# Altium schematic sheet MIRA050CSP-Sheet1.SchDoc: MIRA050 CSP
size A3; Date: 06-May-2024; CheckedBy: -not-used-; Author: -not-used-; CompanyName: AMS; DrawnBy: -not-used-; Engineer: MKOC; Organization: AMs; Address1: Borsbeeksebrug 36; Address2: 2600 Antwerpen; Address3: Belgium; Address4: T: +32 3 260 1730 | F: +32 3 260 1779; Revision: 3.0; SheetNumber: 1; SheetTotal: 1; PageSetup: Record=PageOptions|CenterHorizontal=True|CenterVertical=True|PrintScale=0.71|XCorrection=1.00|YCorrection=1.00|PrintKind=0|BorderSize=5000000|LeftOffset=0|BottomOffset=0|Orientation=2|PaperLength=1000|PaperWidth=1000|Scale=100|PaperSource=7|PrintQuality=-4|MediaType=1|DitherType=10|PrintScaleMode=1|PaperKind=A4|PaperIndex=9; Comment1: Reference Design; Project: MIRA050; ProjectName: -not-used-; Rule: PcbType=ProtelPcb
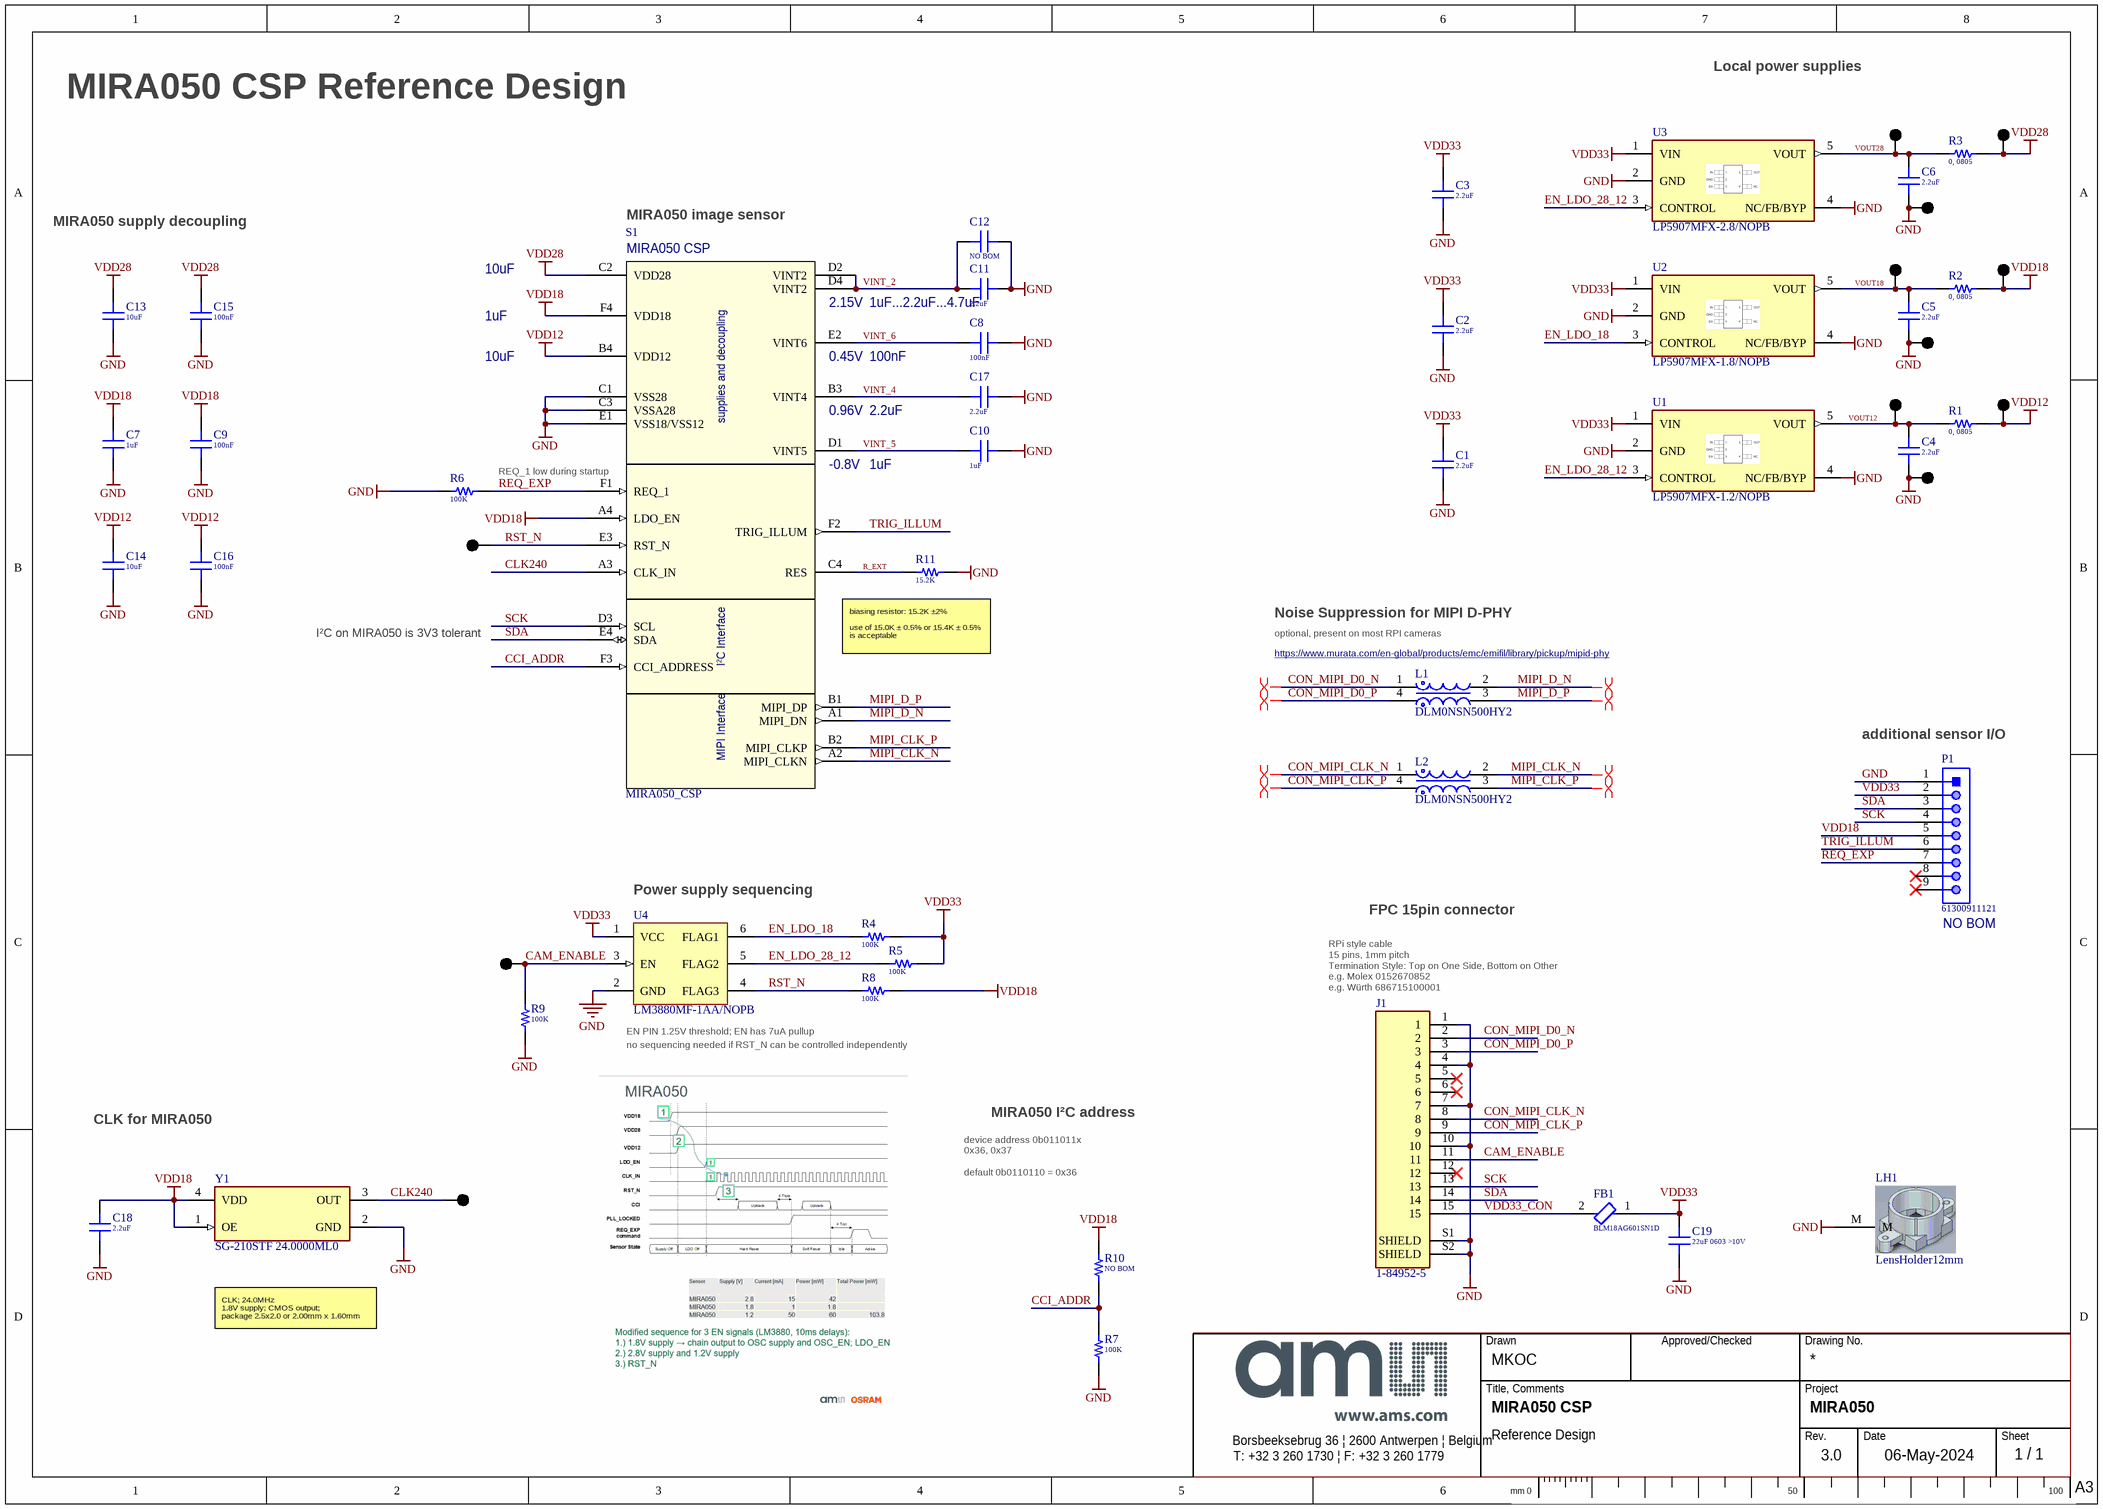
[diagram p0: MIRA050CSP-Sheet1.SchDoc]

## Parts
C1  2.2uF  [CAPC0402_BEMA]
C2  2.2uF  [CAPC0402_BEMA]
C3  2.2uF  [CAPC0402_BEMA]
C4  2.2uF  [CAPC0402_BEMA]
C5  2.2uF  [CAPC0402_BEMA]
C6  2.2uF  [CAPC0402_BEMA]
C7  1uF  [CAPC0402_BEMA]
C8  100nF  [CAPC0402_BEMA]
C9  100nF  [CAPC0402_BEMA]
C10  1uF  [CAPC0402_BEMA]
C11  2.2uF  [CAPC0402_N]
C12  NO BOM  [CAPC0402_N]  (no BOM)
C13  10uF  [CAPC0402_BEMA]
C14  10uF  [CAPC0402_BEMA]
C15  100nF  [CAPC0402_BEMA]
C16  100nF  [CAPC0402_BEMA]
C17  2.2uF  [CAPC0402_BEMA]
C18  2.2uF  [CAPC0402_BEMA]
C19  22uF 0603 >10V  [CAPC0603_BEMA]
FB1  BLM18AG601SN1D  [FP-BLM18-0_15-t0_8-IPC_B]
J1  1-84952-5  [TE_1-84952-5]
L1  DLM0NSN500HY2  [FP-DLM0N-MFG]
L2  DLM0NSN500HY2  [FP-DLM0N-MFG]
LH1  LensHolder12mm  [LensHolder12mmSmount]  (no BOM)
P1  61300911121  [61300911121]  (no BOM)
R1  0, 0805  [RESC0805_BEMA]
R2  0, 0805  [RESC0805_BEMA]
R3  0, 0805  [RESC0805_BEMA]
R4  100K  [RESC0402_BEMA]
R5  100K  [RESC0402_BEMA]
R6  100K  [RESC0402_BEMA]
R7  100K  [RESC0402_BEMA]
R8  100K  [RESC0402_BEMA]
R9  100K  [RESC0402_BEMA]
R10  NO BOM  [RESC0402_BEMA]  (no BOM)
R11  15.2K  [RESC0402_BEMA]
S1  MIRA050_CSP  [MIRA050CSP]
TP1  1V8  [TP_1mm]  (value not drawn)  (no BOM)
TP2  1V2  [TP_1mm]  (value not drawn)  (no BOM)
TP3  TestPoint  [TP_1mm]  (value not drawn)  (no BOM)
TP4  TestPoint  [TP_1mm]  (value not drawn)  (no BOM)
TP5  2V8  [TP_1mm]  (value not drawn)  (no BOM)
TP6  TestPoint  [TP_1mm]  (value not drawn)  (no BOM)
TP7  TestPoint  [TP_075mm]  (value not drawn)  (no BOM)
TP8  TestPoint  [TP_075mm]  (value not drawn)  (no BOM)
TP9  TestPoint  [TP_075mm]  (value not drawn)  (no BOM)
TP10  TestPoint  [TP_1mm]  (value not drawn)  (no BOM)
TP11  TestPoint  [TP_1mm]  (value not drawn)  (no BOM)
TP12  TestPoint  [TP_1mm]  (value not drawn)  (no BOM)
U1  LP5907MFX-1.2/NOPB  [FP-DBV0005A-MFG]
U2  LP5907MFX-1.8/NOPB  [FP-DBV0005A-MFG]
U3  LP5907MFX-2.8/NOPB  [FP-DBV0005A-MFG]
U4  LM3880MF-1AA/NOPB  [DBV0006A_N]
Y1  SG-210STF 24.0000ML0  [2.5x2_OSC]

## Nets
GND: C1.2 C2.2 C3.2 C4.2 C5.2 C6.2 C7.2 C8.2 C9.2 C10.2 C11.2 C12.2 C13.2 C14.2 C15.2 C16.2 C17.2 C18.2 C19.2 J1.1 J1.4 J1.7 J1.10 J1.S1(SHIELD) J1.S2(SHIELD) LH1.M P1.1 R6.1 R7.1 R9.1 R11.2 S1.C1(VSS28) S1.C3(VSSA28) S1.E1(VSS18/VSS12) TP7.1 TP8.1 TP9.1 U1.2(GND) U1.4(NC/FB/BYP) U2.2(GND) U2.4(NC/FB/BYP) U3.2(GND) U3.4(NC/FB/BYP) U4.2(GND) Y1.2(GND)
VDD12: C14.1 C16.1 R1.2 S1.B4(VDD12) TP2.1
VDD18: C7.1 C9.1 C18.1 P1.5 R2.2 R8.2 R10.2 S1.A4(LDO_EN) S1.F4(VDD18) TP1.1 Y1.1(OE) Y1.4(VDD)
VDD28: C13.1 C15.1 R3.2 S1.C2(VDD28) TP5.1
VDD33: C1.1 C2.1 C3.1 C19.1 FB1.1 P1.2 R4.2 R5.2 U1.1(VIN) U2.1(VIN) U3.1(VIN) U4.1(VCC)
CAM_ENABLE: J1.11 R9.2 TP12.1 U4.3(EN)
CCI_ADDR: R7.2 R10.1 S1.F3(CCI_ADDRESS)
CLK240: S1.A3(CLK_IN) TP11.1 Y1.3(OUT)
CON_MIPI_CLK_N: J1.8 L2.1
CON_MIPI_CLK_P: J1.9 L2.4
CON_MIPI_D0_N: J1.2 L1.1
CON_MIPI_D0_P: J1.3 L1.4
EN_LDO_18: R4.1 U2.3(CONTROL) U4.6(FLAG1)
EN_LDO_28_12: R5.1 U1.3(CONTROL) U3.3(CONTROL) U4.5(FLAG2)
MIPI_CLK_N: L2.2 S1.A2(MIPI_CLKN)
MIPI_CLK_P: L2.3 S1.B2(MIPI_CLKP)
MIPI_D_N: L1.2 S1.A1(MIPI_DN)
MIPI_D_P: L1.3 S1.B1(MIPI_DP)
R_EXT: R11.1 S1.C4(RES)
REQ_EXP: P1.7 R6.2 S1.F1(REQ_1)
RST_N: R8.1 S1.E3(RST_N) TP10.1 U4.4(FLAG3)
SCK: J1.13 P1.4 S1.D3(SCL)
SDA: J1.14 P1.3 S1.E4(SDA)
TRIG_ILLUM: P1.6 S1.F2(TRIG_ILLUM)
VDD33_CON: FB1.2 J1.15
VINT_2: C11.1 C12.1 S1.D2(VINT2) S1.D4(VINT2)
VINT_4: C17.1 S1.B3(VINT4)
VINT_5: C10.1 S1.D1(VINT5)
VINT_6: C8.1 S1.E2(VINT6)
VOUT12: C4.1 R1.1 TP3.1 U1.5(VOUT)
VOUT18: C5.1 R2.1 TP4.1 U2.5(VOUT)
VOUT28: C6.1 R3.1 TP6.1 U3.5(VOUT)

Not connected (* = marked no-connect by the designer): J1 5* 6* 12*; P1 8* 9*

## Layout directives
differential pair: CON_MIPI_CLK_N, CON_MIPI_CLK_P, CON_MIPI_D0_N, CON_MIPI_D0_P, MIPI_CLK_N, MIPI_CLK_P, MIPI_D_N, MIPI_D_P

## Notes on the sheet
- MIRA050 CSP Reference Design
- Local power supplies
- MIRA050 supply decoupling
- (near S1) MIRA050 image sensor
- 10uF
- 1uF
- (near S1) 2.15V
- (near C11) 1uF...2.2uF...4.7uF
- (near S1) 0.45V
- 100nF
- (near S1) 0.96V
- 2.2uF
- (near S1) REQ_1 low during startup
- (near S1) -0.8V
- I²C on MIRA050 is 3V3 tolerant
- biasing resistor: 15.2K ±2%
  use of 15.0K ± 0.5% or 15.4K ± 0.5% is acceptable
- Noise Suppression for MIPI D-PHY
- (near L1) https://www.murata.com/en-global/products/emc/emifil/library/pickup/mipid-phy
- (near L1) optional, present on most RPI cameras
- (near P1) additional sensor I/O
- (near U4) Power supply sequencing
- FPC 15pin connector
- (near P1) NO BOM
- (near J1) RPi style cable
  15 pins, 1mm pitch
  Termination Style: Top on One Side, Bottom on Other
  e.g. Molex 0152670852
  e.g. Würth 686715100001
- no sequencing needed if RST_N can be controlled independently
- EN PIN 1.25V threshold; EN has 7uA pullup
- CLK for MIRA050
- MIRA050 I²C address
- device address 0b011011x
  0x36, 0x37
  default 0b0110110 = 0x36
- CLK; 24.0MHz
  1.8V supply; CMOS output;
  package 2.5x2.0 or 2.00mm x 1.60mm
- Title, Comments
- Drawn
- Approved/Checked
- Drawing No.
- Project
- Borsbeeksebrug 36 | 2600 Antwerpen | Belgium
- T: +32 3 260 1730 | F: +32 3 260 1779
- Rev.
- Date
- Sheet
- mm 0
- 50
- 100
- A3
- (in symbol MIRA050_CSP) MIRA050 CSP; supplies and decoupling; I²C Interface; MIPI Interface

## Library data of the parts
C1-C6 C11 C17 C18 = Capacitor: SMT Capacitor; Part Number: GRM155R61E225ME15D
C7 C10 = Capacitor: SMT Capacitor; Part Number: GRM155Z71A105KE01
C8 C9 C15 C16 = Capacitor: SMT Capacitor; Part Number: GRM155R71E104KE14J
C12 = Capacitor: SMT Capacitor; Part Number: *
C13 C14 = Capacitor: SMT Capacitor; Part Number: GRM155R60J106ME15D
C19 = Capacitor: SMT Capacitor; Part Number: GRM187R61A226ME15D
FB1 = CMP-0686-00436-3: Chip Ferrite Bead, 0603, 600Ω @ 100MHz, 0.38Ω, 25%, 500mA; Number of Lines: 1; Impedance: 600R; DC Resistance (DCR): 380mR; Material: Steel; Shielding: Unshielded; Max DC Current: 500mA; Termination: SMD/SMT; Military Standard: Not; Number of Circuits: 1; Min Operating Temperature: -55°C; Case Code (Imperial): 0603; Width: 0.8mm; Current Rating: 500mA; Lead Free: Lead Free; Packaging: Tape and Reel; Frequency: 100MHz; Max Operating Temperature: 125°C; DC Current: 500mA; REACH SVHC: No SVHC; Case/Package: 0603; Package Quantity: 1; Height: 0.8mm; Number of Pins: 2; Depth: 0.8mm; Test Frequency: 100MHz; Case Code (Metric): 1608; Tolerance: 25%; Core Material: Ferrite; Weight: 7.1E-05oz; Max Current Rating: 500mA; Radiation Hardening: No; Length: 1.6mm; RoHS Compliant: Yes; Part Number: BLM18AG601SN1D
J1 = 1-84952-5: Conn FPC Connector SKT 15 POS 1mm Solder RA SMD T/R; Part Number: 1-84952-5
L1 L2 = CMP-2000-06161-2_1: Common Mode Choke 50Ohm 100mA 4-Pin 03025 Paper T/R; Manufacturer: Murata; Manufacturer Part Number: DLM0NSN500HY2D; Supplier 1: RSComponents; Supplier Part Number 1: 2235025; RoHS: Yes; Category: Common Mode Chokes; Stock 1: 9350; Pricing 1: 50=0.07600, 250=0.07100, 500=0.05800, 1000=0.05300, 2500=0.04700 (GBP); Part Number: DLM0NSN500HY2
P1 = CMP-1502-01080-1: THT Vertical Pin Header WR-PHD, Pitch 2.54 mm, Single Row, 9 pins; Manufacturer: Wurth Elektronik; Pitch: 2.54mm; Gender: Male; Working Voltage: 250VAC; Contact Resistance: 20mOhm; Withstanding Voltage: 500VAC; Pin Number: 9; Rated Current: 3A; Package Reference: 61300911121; Part Number: 61300911121; Mounting Technology: THT; Publisher: WurthElektronik; Manufacturer URL: http://www.we-online.de; Orientation: Vertical; Datasheet URL: https://katalog.we-online.de/em/datasheet/6130xx11121.pdf; Operating Temperature: -40to105degC; Row Number: Single; Packaging: Bag
R1-R3 = Resistor: SMT Resistor; Part Number: 0, 0805, generic
R4-R9 = Resistor: SMT Resistor; Part Number: 100K 0402, generic
R10 = Resistor: SMT Resistor; Part Number: *
R11 = Resistor: SMT Resistor; Part Number: RN73R1ETTP1522B25
S1 = MIRA050_CSP: AMS-OSRAM MIRA050 CSP, MONO; Part Number: Mira050-2QM1WB
TP1-TP9 = TestPoint: Test Point, various footprints
TP10-TP12 = 5001: Test Point, various footprints
U1-U3 = LDO-STO23-5: IC REG LINEAR fixed Voltage, SOT23-5 / SOT-25 / SC74A package; Mount: Surface Mount
  U1: Part Number: LP5907MFX-1.2/NOPB
  U2: Part Number: LP5907MFX-1.8/NOPB
  U3: Part Number: LP5907MFX-2.8/NOPB
U4 = CMP-0063-01015-4: Power Sequencer, 6-pin SOT-23, Pb-Free, 1000 Reel; Part Number: LM3880MF-1AA/NOPB
Y1 = OSC: OSC, 24MHz, 1.8V, CMOS, EN; Device Class L3: Oscillators; ComponentLink2URL: http://ww1.microchip.com/downloads/en/DeviceDoc/20005624B.pdf; ComponentLink2Description: Datasheet; Part Number: SG-210STF 24.0000ML0